# EAGLE design mux chip test mk2 (EAGLE 7.2.0)
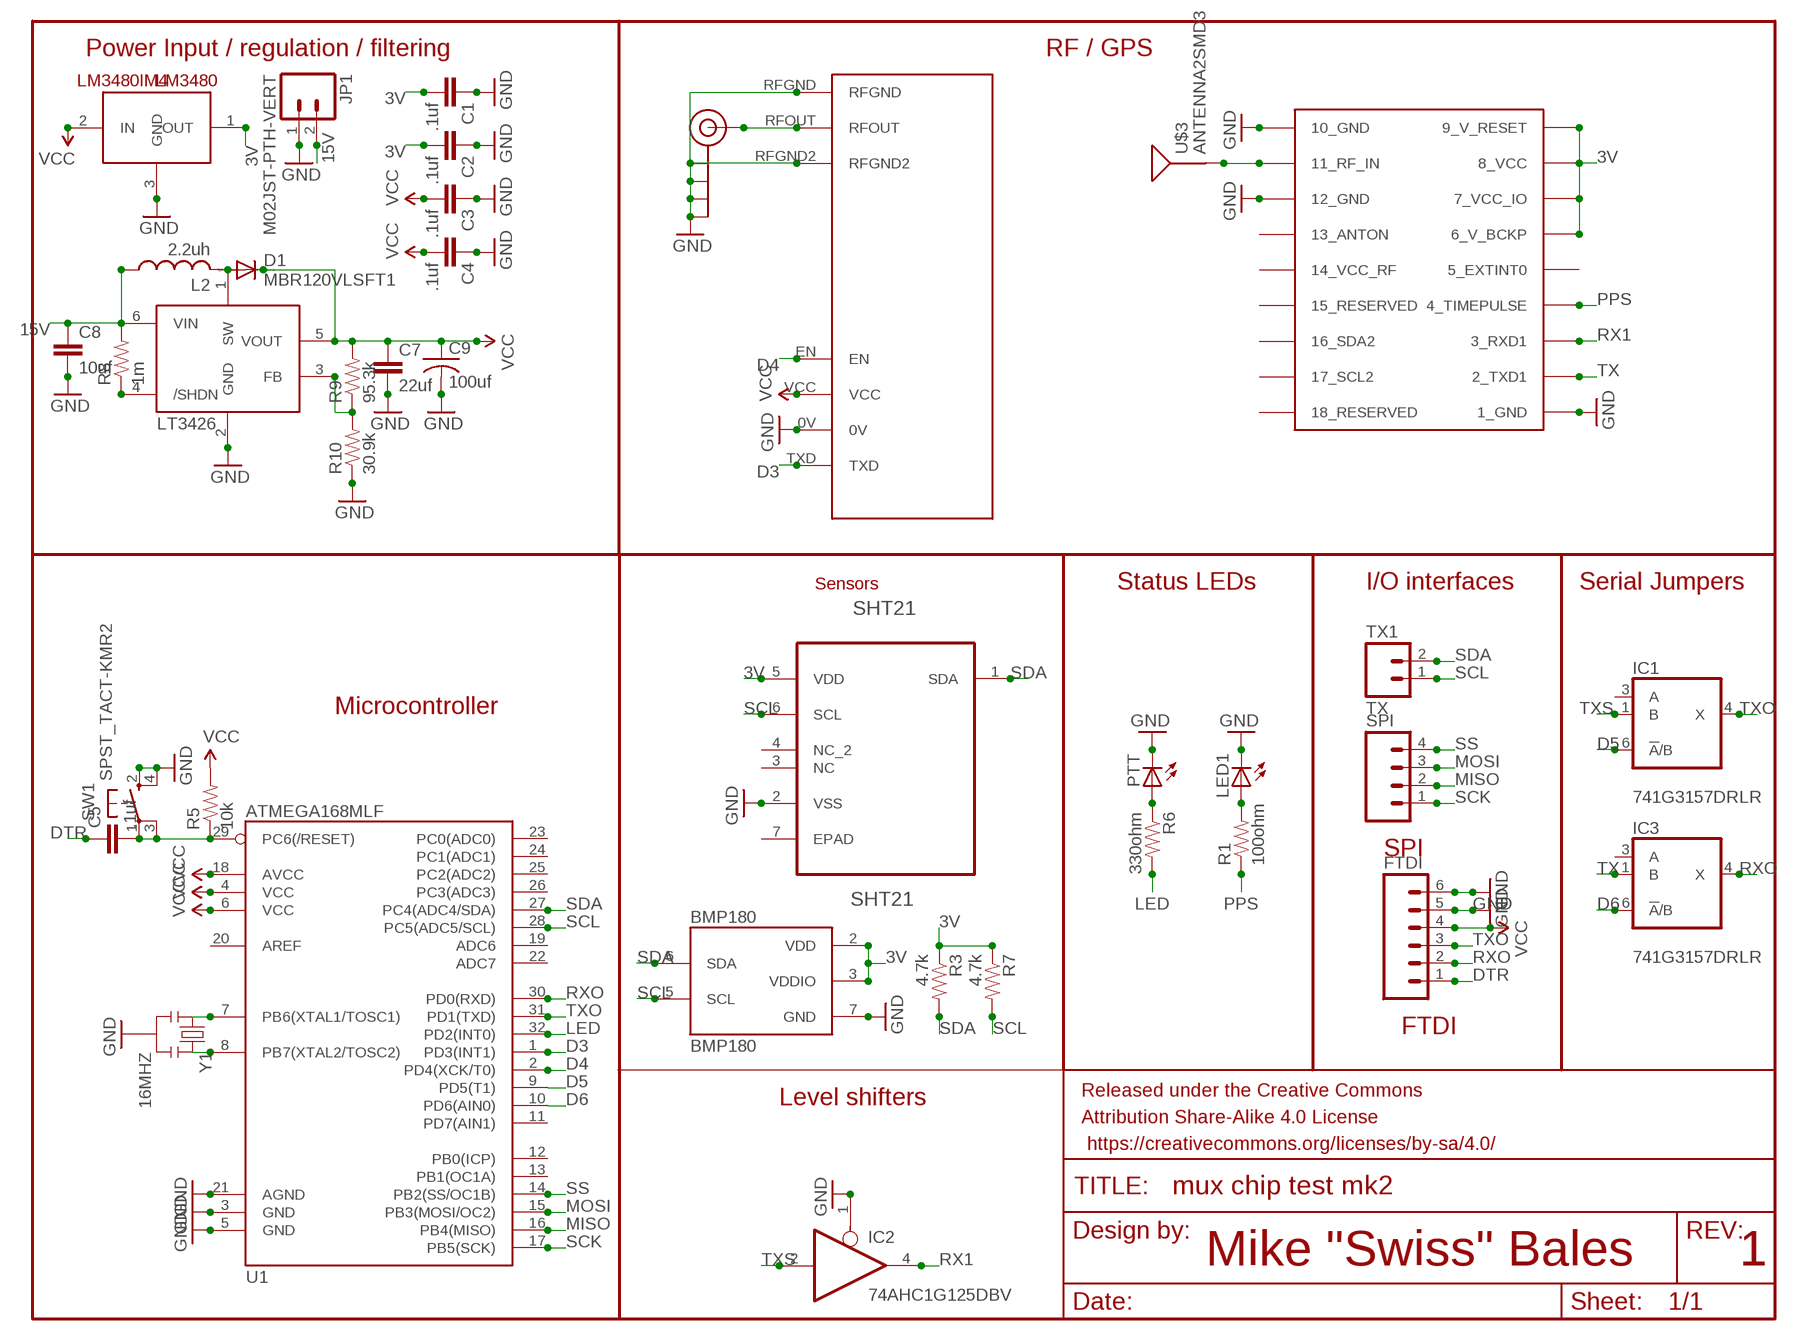
[diagram p0: schematic, sheet 1]

## Parts
BMP180  BMP180  [BMP180]
C1  .1uf  CAP0805  [0805]
C2  .1uf  CAP0805  [0805]
C3  .1uf  CAP0805  [0805]
C4  .1uf  CAP0805  [0805]
C5  .1uf  CAP0805  [0805]
C7  22uf  CAP0805  [0805]
C8  10uf  CAP0805  [0805]
C9  100uf  C-USC1206  [C1206]
D1  MBR120VLSFT1  DIODE-SOD123  [SOD123]
FRAME1  FRAME-LETTER  [CREATIVE_COMMONS]
FTDI  M06NO_SILK_FEMALE_PTH  [1X06_NO_SILK]
IC1  741G3157DRLR  [DRL_R-PDSO-N6]
IC2  74AHC1G125DBV  [SOT23-5]
IC3  741G3157DRLR  [DRL_R-PDSO-N6]
J$1  SMA_EDGE  [SMA-EDGE]
JP1  M02JST-PTH-VERT  [JST-2-PTH-VERT]
L2  2.2uh  L-USL1812  [L1812]
LED1  LEDCHIP-LED0805  [CHIP-LED0805]
LM3480  LM3480IM4  [SOT23-3]
LT3426  LT3426  [SOT23-6]
PTT  LEDCHIP-LED0805  [CHIP-LED0805]
R1  100ohm  RESISTOR0805-RES  [0805]
R3  4.7k  RESISTOR0805-RES  [0805]
R5  10k  RESISTOR0805-RES  [0805]
R6  330ohm  RESISTOR0805-RES  [0805]
R7  4.7k  RESISTOR0805-RES  [0805]
R8  1m  RESISTOR0805-RES  [0805]
R9  95.3k  RESISTOR0805-RES  [0805]
R10  30.9k  RESISTOR0805-RES  [0805]
SHT21  SHT21  [DFN300X300X110-7N]
SPI  M04JST-PTH-VERT  [JST-4-PTH-VERT]
SW1  SPST_TACT-KMR2  [KMR2]
TX1  TX  M02JST-PTH-VERT  [JST-2-PTH-VERT]
U1  ATMEGA168MLF  [MLF32]
U$1  UBLOX_MAX  [UBLOX_MAX]
U$2  RADIOMETRIX-HX1  [RADIOMETRIX-HX1]
U$3  ANTENNA2SMD3  [ANTENNA-CHIP4]
Y1  16MHZ  RESONATOR16MHZ  [RESONATOR-SMD]

## Nets
3V: BMP180.2(VDD) BMP180.3(VDDIO) C1.2 C2.2 LM3480.1(OUT) R3.1 R7.1 SHT21.5(VDD) U$1.6_V_BCKP U$1.7_VCC_IO U$1.8_VCC U$1.9_V_RESET
15V: C8.1 JP1.2 L2.1 LT3426.6(VIN) R8.2
D3: U1.1(PD3(INT1)) U$2.TXD
D4: U1.2(PD4(XCK/T0)) U$2.EN
D5: IC1.6(!A!/B) U1.9(PD5(T1))
D6: IC3.6(!A!/B) U1.10(PD6(AIN0))
DTR: C5.1 FTDI.1
GND: BMP180.7(GND) C1.1 C2.1 C3.1 C4.1 C7.2 C8.2 C9.2 FTDI.5 FTDI.6 IC2.1(OE) J$1.GND@0(GND) J$1.GND@1(GND) J$1.GND@2(GND) J$1.GND@3(GND) JP1.1 LED1.C LM3480.3(GND) LT3426.2(GND) PTT.C R10.1 SHT21.2(VSS) SW1.2(S) SW1.4(S1) U1.3(GND) U1.5(GND) U1.21(AGND) U$1.1_GND U$1.10_GND U$1.12_GND U$2.0V U$2.RFGND U$2.RFGND2 Y1.2
LED: R6.2 U1.32(PD2(INT0))
MISO: SPI.2 U1.16(PB4(MISO))
MOSI: SPI.3 U1.15(PB3(MOSI/OC2))
N$1: J$1.SIG(SIGNAL) U$2.RFOUT
N$3: LED1.A R1.2
N$6: U$1.11_RF_IN U$3.SIG(SIGNAL)
N$9: D1.A L2.2 LT3426.1(SW)
N$12: LT3426.4(/SHDN) R8.1
N$13: LT3426.3(FB) R9.1 R10.2
N$14: U1.8(PB7(XTAL2/TOSC2)) Y1.3
N$17: C5.2 R5.1 SW1.1(P) SW1.3(P1) U1.29(PC6(/RESET))
N$26: U1.7(PB6(XTAL1/TOSC1)) Y1.1
N$27: PTT.A R6.1
PPS: R1.1 U$1.4_TIMEPULSE
RX1: IC2.4(O) U$1.3_RXD1
RXO: FTDI.2 IC3.4(X) U1.30(PD0(RXD))
SCK: SPI.1 U1.17(PB5(SCK))
SCL: BMP180.5(SCL) R7.2 SHT21.6(SCL) TX1.1 U1.28(PC5(ADC5/SCL))
SDA: BMP180.6(SDA) R3.2 SHT21.1(SDA) TX1.2 U1.27(PC4(ADC4/SDA))
SS: SPI.4 U1.14(PB2(SS/OC1B))
TX: IC3.1(B) U$1.2_TXD1
TXO: FTDI.3 IC1.4(X) U1.31(PD1(TXD))
TXS: IC1.1(B) IC2.2(I)
VCC: C3.2 C4.2 C7.1 C9.1 D1.C FTDI.4 LM3480.2(IN) LT3426.5(VOUT) R5.2 R9.2 U1.4(VCC) U1.6(VCC) U1.18(AVCC) U$2.VCC
Unconnected: IC1.3(A) IC3.3(A) SHT21.3(NC) SHT21.4(NC_2) SHT21.7(EPAD) U1.11(PD7(AIN1)) U1.12(PB0(ICP)) U1.13(PB1(OC1A)) U1.19(ADC6) U1.20(AREF) U1.22(ADC7) U1.23(PC0(ADC0)) U1.24(PC1(ADC1)) U1.25(PC2(ADC2)) U1.26(PC3(ADC3)) U$1.5_EXTINT0 U$1.13_ANTON U$1.14_VCC_RF U$1.15_RESERVED U$1.16_SDA2 U$1.17_SCL2 U$1.18_RESERVED

## Notes on the sheet
- Power Input / regulation / filtering | RF / GPS
- Sensors | Status LEDs | I/O interfaces | Serial Jumpers
- Microcontroller
- SPI
- FTDI
- Level shifters
- Mike "Swiss" Bales | 1

## Power pins joined to a net without a drawn wire
GND: IC1.2(GND) IC2.3(GND) IC3.2(GND)
VCC: IC1.5(VCC) IC2.5(VCC) IC3.5(VCC)

## Library data of the parts
BMP180 = SparkFun-Sensors:BMP180: BOSCH BMP180 DIGITAL BAROMETRIC PRESSURE SENSOR Web page: http://www.bosch-sensortec.com/en/homepage/products_3/environmental_sensors_1/bmp180_1/bmp180 Datasheet: http://ae-bst.resource.bosch.com/media/products/dokumente/bmp180/BST-BMP180-DS000-09.pdf The BMP180 is the function compatible successor of the BMP085, a new generation of high precision digital pressure sensors for consumer applications. The ultra-low power, low voltage electronics of the BMP180 is optimized for use in mobile phones, PDAs, GPS navigation devices and outdoor equipment. With a low altitude noise of merely 0.25m at fast conversion time, the BMP180 offers superior performance. The I2C interface allows for easy system integration with a microcontroller. The BMP180 is based on piezo-resistive technology for EMC robustness, high accuracy and linearity as well as long term stability. Key features: - Temperature measurement included - I2C interface - Fully calibrated - Pb-free, halogen-free and RoHS compliant, - MSL 1 Basic specs: Pressure range: 300 to 1100hPa (+9000m to -500m relating to sea level) Supply voltage: 1.8 to 3.6V (VDD), 1.62V to 3.6V (VDDIO) Package: LGA package with metal lid Small footprint: 3.6mm x 3.8mm Super-flat: 0.93mm height Low power: 5μA at 1 sample / sec. in standard mode Low noise: 0.06hPa (0.5m) in ultra low power mode, 0.02hPa (0.17m) advanced resolution mode Typical applications: - Enhancement of GPS navigation (dead-reckoning, slope detection, etc.) - In- and out-door navigation - Leisure and sports - Weather forecast - Vertical velocity indication (rise/sink speed)
C1-C5 C7 C8 = SparkFun-Capacitors:CAP: Capacitor Standard 0603 ceramic capacitor, and 0.1" leaded capacitor.
C9 = resistor:C-US: CAPACITOR, American symbol
D1 = diode:DIODE-: DIODE
FRAME1 = SparkFun-Aesthetics:FRAME-LETTER: Schematic Frame Standard 8.5x11 US Letter frame
FTDI = SparkFun-Connectors:M06: Header 6 Standard 6-pin 0.1" header. Use with straight break away headers (SKU : PRT-00116), right angle break away headers (PRT-00553), swiss pins (PRT-00743), machine pins (PRT-00117), and female headers (PRT-00115). Molex polarized connector foot print use with SKU : PRT-08094 with associated crimp pins and housings. NOTES ON THE VARIANTS LOCK and LOCK_LONGPADS... This footprint was designed to help hold the alignment of a through-hole component (i.e. 6-pin header) while soldering it into place. You may notice that each hole has been shifted either up or down by 0.005 of an inch from it's more standard position (which is a perfectly straight line). This slight alteration caused the pins (the squares in the middle) to touch the edges of the holes. Because they are alternating, it causes a "brace" to hold the component in place. 0.005 has proven to be the perfect amount of "off-center" position when using our standard breakaway headers. Although looks a little odd when you look at the bare footprint, once you have a header in there, the alteration is very hard to notice. Also,if you push a header all the way into place, it is covered up entirely on the bottom side. This idea of altering the position of holes to aid alignment will be further integrated into the Sparkfun Library for other footprints. It can help hold any component with 3 or more connection pins.; PROD_ID: CONN-08437
IC1 IC3 = 74xx-little-us:74*1G3157: Single-Pole, Double-Throw Analog Switch Source: http://focus.ti.com/lit/ds/symlink/sn74lvc1g3157.pdf
IC2 = 74xx-little-us:74*1G125: Single Bus Buffer Gate with 3-State Output
J$1 = SparkFun-Connectors:SMA_EDGE: SMA Antenna Connector End launch SMA connector. The paste layer has been removed so that the connector can be hand soldered onto the board after reflow.
JP1 TX1 = SparkFun-Connectors:M02: Standard 2-pin 0.1" header. Use with - straight break away headers ( PRT-00116) - right angle break away headers (PRT-00553) - swiss pins (PRT-00743) - machine pins (PRT-00117) - female headers (PRT-00115) Molex polarized connector foot print use with: PRT-08233 with associated crimp pins and housings. 2.54_SCREWTERM for use with PRT-10571. 3.5mm Screw Terminal footprints for PRT-08084 5mm Screw Terminal footprints for use with PRT-08432
L2 = resistor:L-US: INDUCTOR, American symbol
LED1 PTT = adafruit:LED: LED OSRAM: - CHIPLED LG R971, LG N971, LY N971, LG Q971, LY Q971, LO R971, LY R971 LH N974, LH R974 LS Q976, LO Q976, LY Q976 LO Q996 - Hyper CHIPLED LW Q18S LB Q993, LB Q99A, LB R99A - SideLED LS A670, LO A670, LY A670, LG A670, LP A670 LB A673, LV A673, LT A673, LW A673 LH A674 LY A675 LS A676, LA A676, LO A676, LY A676, LW A676 LS A679, LY A679, LG A679 - Hyper Micro SIDELED® LS Y876, LA Y876, LO Y876, LY Y876 LT Y87S - SmartLED LW L88C, LW L88S LB L89C, LB L89S, LG L890 LS L89K, LO L89K, LY L89K LS L896, LA L896, LO L896, LY L896 - TOPLED LS T670, LO T670, LY T670, LG T670, LP T670 LSG T670, LSP T670, LSY T670, LOP T670, LYG T670 LG T671, LOG T671, LSG T671 LB T673, LV T673, LT T673, LW T673 LH T674 LS T676, LA T676, LO T676, LY T676, LB T676, LH T676, LSB T676, LW T676 LB T67C, LV T67C, LT T67C, LS T67K, LO T67K, LY T67K, LW E67C LS E67B, LA E67B, LO E67B, LY E67B, LB E67C, LV E67C, LT E67C LW T67C LS T679, LY T679, LG T679 LS T770, LO T770, LY T770, LG T770, LP T770 LB T773, LV T773, LT T773, LW T773 LH T774 LS E675, LA E675, LY E675, LS T675 LS T776, LA T776, LO T776, LY T776, LB T776 LHGB T686 LT T68C, LB T68C - Hyper Mini TOPLED® LB M676 - Mini TOPLED Santana® LG M470 LS M47K, LO M47K, LY M47K Source: http://www.osram.convergy.de/
LM3480 = SparkFun-PowerIC:LM3480IM4: Small package linear regulator
LT3426 = adafruit:LT3426: LT3426 1.2MHz, 2A boost converter in SOT-23 http://www.linear.com/pc/productDetail.jsp?navId=H0,C1,C1003,C1042,C1031,C1061,P8430 (Linear website)
R1 R3 R5-R10 = SparkFun-Resistors:RESISTOR: Resistor Basic schematic elements and footprints for 0603, 1206, and PTH resistors.
SHT21 = sht21:SHT21: SENSOR, HUMIDITY & TEMP; MPN: SHT21; OC_FARNELL: 1855468; OC_NEWARK: 20T1172; PACKAGE: DFN-6; SUPPLIER: SENSIRION
SPI = SparkFun-Connectors:M04: Header 4 Standard 4-pin 0.1" header. Use with straight break away headers (SKU : PRT-00116), right angle break away headers (PRT-00553), swiss pins (PRT-00743), machine pins (PRT-00117), and female headers (PRT-00115). Molex polarized connector foot print use with SKU : PRT-08231 with associated crimp pins and housings. 1MM SMD Version SKU: PRT-10208
SW1 = adafruit:SPST_TACT: SMT 6mm switch, EVQQ2 series http://www.ladyada.net/library/eagle
U1 = SparkFun-DigitalIC:ATMEGA168: Atmel 32-pin 8-bit micro, 16k flash.
U$1 = Ava:UBLOX_MAX: UBLOX MAX
U$2 = Ava:RADIOMETRIX-HX1
U$3 = SparkFun-RF:ANTENNA2: Chip antenna Single endded antenna. Common with smaller chip antennas. CHIP4 package is the GPS Chip Antenna SKU: GPS-08418. CHIP5 package is 2.4GHz chip antenna SKU: WRL-00144.
Y1 = SparkFun-FreqCtrl:RESONATOR: Resonator Small SMD resonator. Used, eg, on the Arduino Pro/ Pro Mini boards. 8MHz- XTAL-08895 16MHz- XTAL-08900; PROD_ID: XTAL-08900

## Board
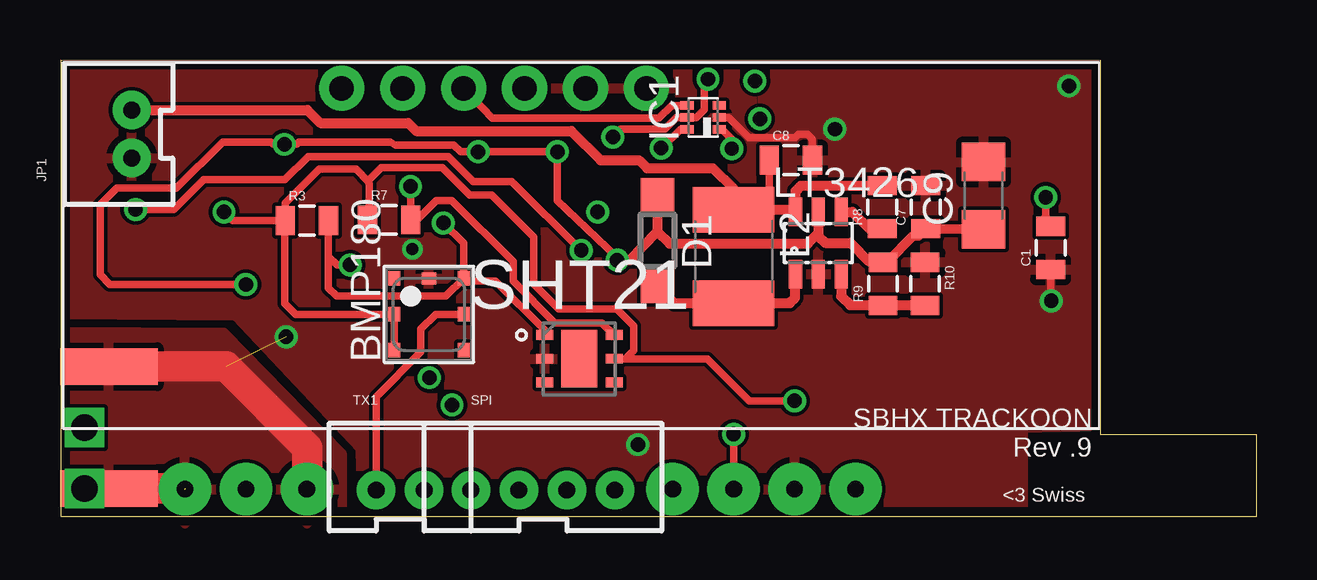
[diagram p1: board, top side]
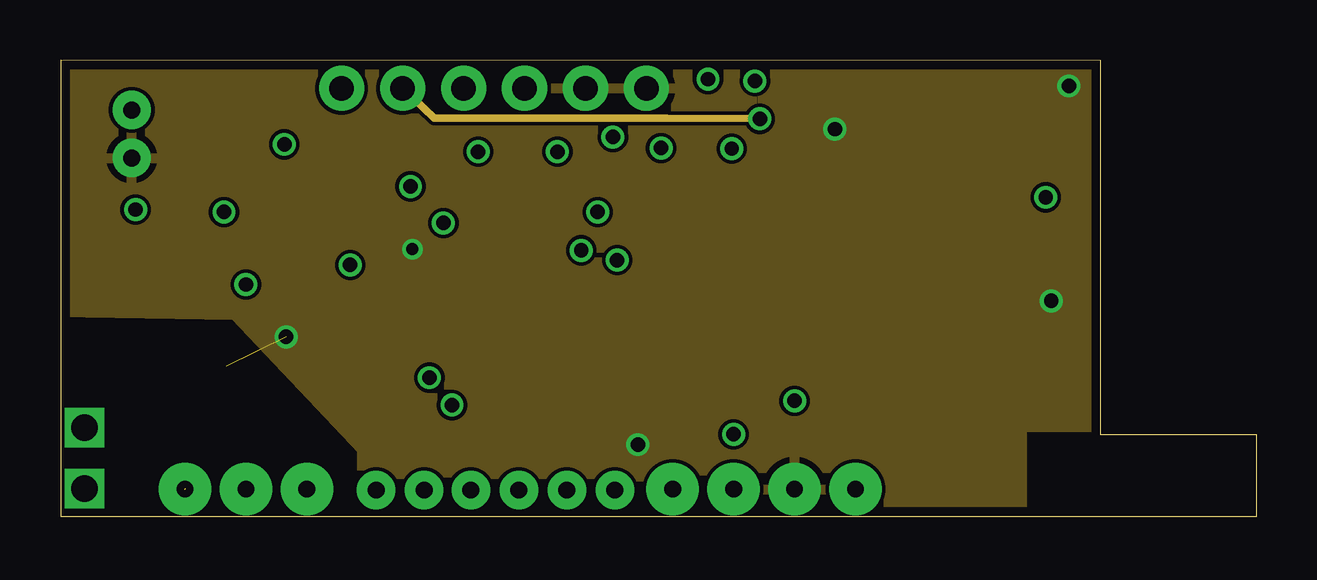
[diagram p2: board, inner layer Route2]
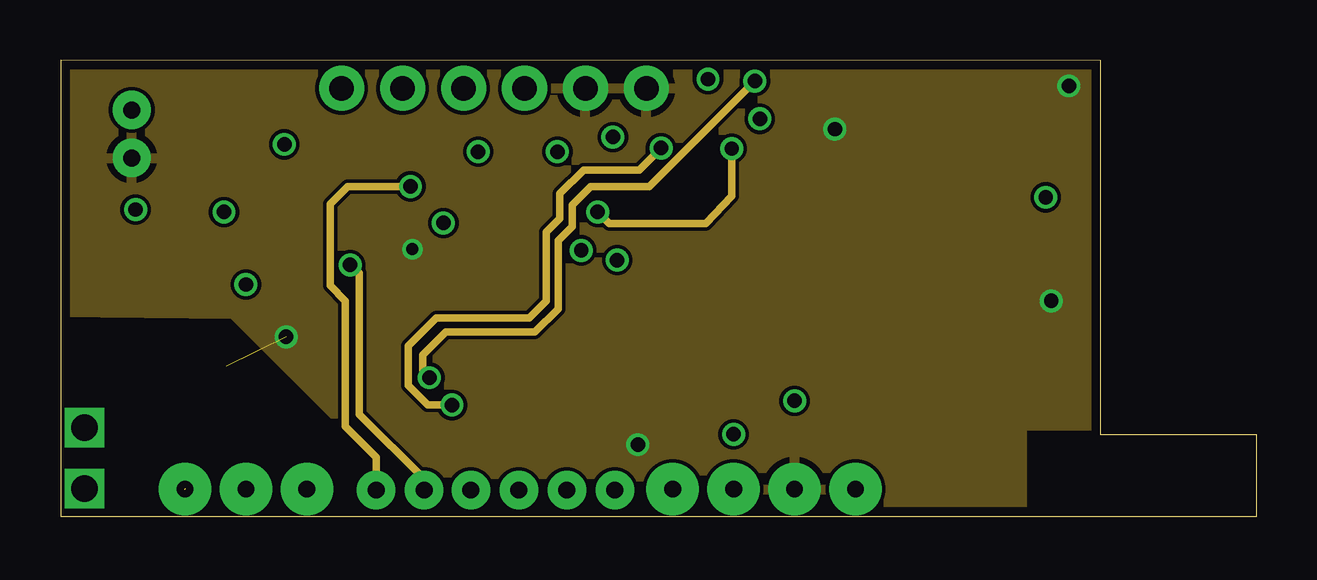
[diagram p3: board, inner layer Route15]
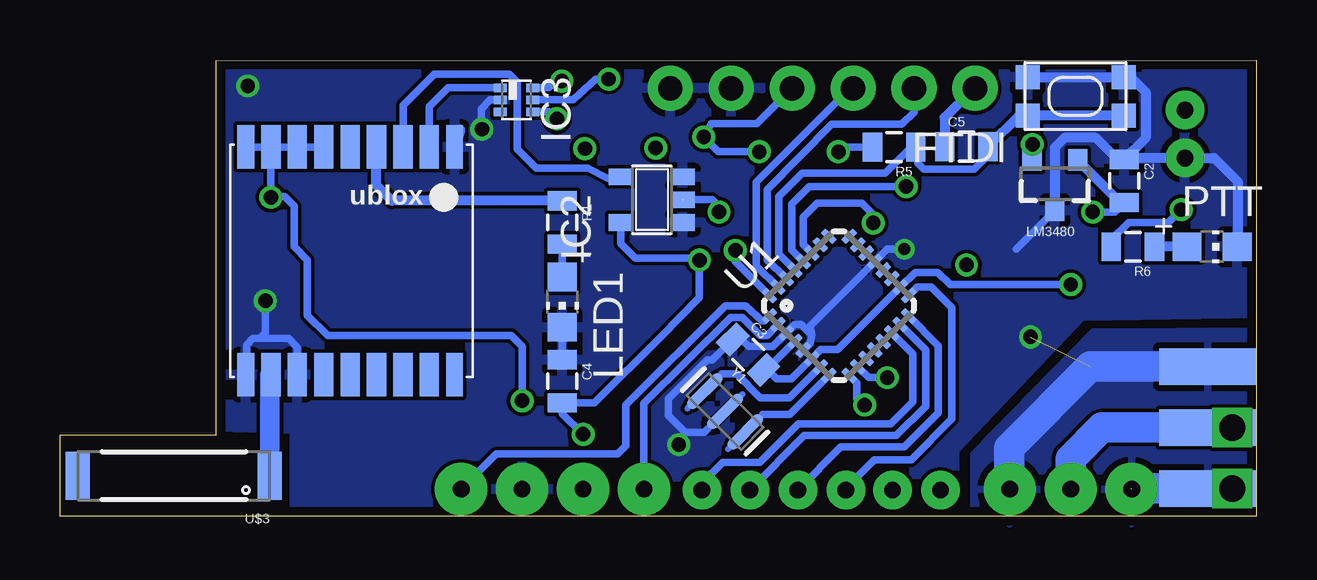
[diagram p4: board, bottom side, seen from below]

Size 49.83 x 19.04 mm. Coordinates in mm from the lower left corner, seen from the top.
Outline: 0,0 49.84,0 49.84,3.4 43.33,3.4 43.33,3.45 43.33,19.02 0,19.04 0,0
Copper layers (1*2*15*16): Top 0.0356mm / dielectric 1.5011mm / Route2 0.0356mm / dielectric 0.1499mm / Route15 0.0356mm / dielectric 0.2007mm / Bottom 0.0356mm
Design rules "oshpark-2layer *": minimum track width 6mil, minimum drill 13mil, track to track 6mil, track to pad 6mil, pad to pad 6mil, via to via 6mil, smd to smd 6mil, copper to edge 15mil, drill to drill 6mil, minimum pad ring 7mil, minimum via ring 7mil, stop-mask expansion 4mil, vias tented up to drill 0mil, thermal gap 10mil

### Footprints (pad centres in the part's own frame; a part is rotated, then mirrored left to right if it is on the bottom)
BMP180 = smd 0.6 x 0.5: 1 1.5,1.45; 2 0,1.45; 3 -1.5,1.45; 4 -1.5,-1.45; 5 0,-1.45; 6 1.5,-1.45 | smd 0.5 x 0.6: 7 1.5,0
0805 = smd 0.8 x 1.2: 1 -0.9,0; 2 0.9,0
C1206 = smd 1.6 x 1.8: 1 -1.4,0; 2 1.4,0
SOD123 = smd 1.4 x 1.4: A 1.9,0; C -1.9,0
1X06_NO_SILK = drill 1.016 pad 1.88: 1 0,0; 2 2.54,0; 3 5.08,0; 4 7.62,0; 5 10.16,0; 6 12.7,0
DRL_R-PDSO-N6 = smd 0.35 x 0.55: 1 -0.5,-0.675; 2 0,-0.675; 3 0.5,-0.675; 4 0.5,0.675; 5 0,0.675; 6 -0.5,0.675
SOT23-5 = smd 0.69 x 0.99: 1 -0.95,-1.29; 2 0,-1.29; 3 0.95,-1.29; 4 0.95,1.3; 5 -0.95,1.3
SMA-EDGE = smd 1.524 x 4.064: GND@0 0,0; GND@1 5.08,0; SIG 2.54,0 | smd 1.524 x 4.064 bottom: GND@2 0,0; GND@3 5.08,0
JST-2-PTH-VERT = drill 0.7 pad 1.6: 1 -1,-0.55; 2 1,-0.55
L1812 = smd 1.9 x 3.4: 1 -1.95,0; 2 1.95,0
CHIP-LED0805 = smd 1.2 x 1.2: A 0,-1.05; C 0,1.05
SOT23-3 = smd 0.8 x 0.9: 1 -0.95,-1; 2 0.95,-1; 3 0,1.1
SOT23-6 = smd 0.55 x 1.2: 1 -0.95,-1.3; 2 0,-1.3; 3 0.95,-1.3; 4 0.95,1.3; 5 0,1.3; 6 -0.95,1.3
DFN300X300X110-7N = smd 0.711 x 0.406: 1 -1.448,0.991; 2 -1.448,0; 3 -1.448,-0.991; 4 1.448,-0.991; 5 1.448,0; 6 1.448,0.991 | smd 1.499 x 2.388: 7 0,0
JST-4-PTH-VERT = drill 0.7 pad 1.6: 1 -3,-0.55; 2 -1,-0.55; 3 1,-0.55; 4 3,-0.55
KMR2 = smd 1 x 1: 1 2,0.8; 2 2,-0.8; 3 -2,0.8; 4 -2,-0.8
MLF32 = smd 0.7 x 0.3: 1 -2.35,1.75; 2 -2.35,1.25; 3 -2.35,0.75; 4 -2.35,0.25; 5 -2.35,-0.25; 6 -2.35,-0.75; 7 -2.35,-1.25; 8 -2.35,-1.75; 17 2.35,-1.75; 18 2.35,-1.25; 19 2.35,-0.75; 20 2.35,-0.25; 21 2.35,0.25; 22 2.35,0.75; 23 2.35,1.25; 24 2.35,1.75 | smd 0.3 x 0.7: 9 -1.75,-2.35; 10 -1.25,-2.35; 11 -0.75,-2.35; 12 -0.25,-2.35; 13 0.25,-2.35; 14 0.75,-2.35; 15 1.25,-2.35; 16 1.75,-2.35; 25 1.75,2.35; 26 1.25,2.35; 27 0.75,2.35; 28 0.25,2.35; 29 -0.25,2.35; 30 -0.75,2.35; 31 -1.25,2.35; 32 -1.75,2.35
UBLOX_MAX = smd 1.8 x 0.7: 1_GND 4.95,-4.4; 9_V_RESET 4.95,4.3; 10_GND -4.55,4.3; 18_RESERVED -4.55,-4.4 | smd 1.8 x 0.8: 2_TXD1 4.95,-3.35; 3_RXD1 4.95,-2.25; 4_TIMEPULSE 4.95,-1.15; 5_EXTINT0 4.95,-0.05; 6_V_BCKP 4.95,1.05; 7_VCC_IO 4.95,2.15; 8_VCC 4.95,3.25; 11_RF_IN -4.55,3.25; 12_GND -4.55,2.15; 13_ANTON -4.55,1.05; 14_VCC_RF -4.55,-0.05; 15_RESERVED -4.55,-1.15; 16_SDA2 -4.55,-2.25; 17_SCL2 -4.55,-3.35
RADIOMETRIX-HX1 = drill 0.7 pad 2.184: 0V 8.89,-10.16; EN 3.81,-10.16; RFGND -11.43,-10.16; RFGND2 -16.51,-10.16; RFOUT -13.97,-10.16; TXD 11.43,-10.16; VCC 6.35,-10.16
ANTENNA-CHIP4 = smd 1 x 2: NC 4,0; SIG -4,0
RESONATOR-SMD = smd 0.45 x 1.905: 1 -1.2,0; 2 0,0; 3 1.2,0

### Placement (x,y rotation side)
BMP180  15.34,8.43 90 top
C1  41.25,11.2 90 top
C2  5.49,14 270 bottom
C3  21.16,6.76 315 bottom
C4  28.91,5.64 270 bottom
C5  12.07,15.43 0 bottom
C7  36.04,12.9 90 top
C8  30.43,14.86 0 top
C9  38.46,13.39 90 top
D1  24.87,11.51 270 top
FRAME1  14.38,-8.15 0 top  (outside the outline)
FTDI  11.71,17.86 180 bottom
IC1  26.77,16.64 90 top
IC2  25.17,13.21 90 bottom
IC3  30.81,17.37 270 bottom
J$1  2.01,1.17 90 bottom
JP1  2.41,15.95 90 top
L2  28.04,10.85 270 top
LED1  28.91,8.94 180 bottom
LM3480  8.38,13.87 180 bottom
LT3426  31.57,11.4 0 top
PTT  1.83,11.25 270 bottom
R1  28.91,12.27 270 bottom
R3  10.26,12.34 0 top
R5  15.08,15.41 180 bottom
R6  5.13,11.25 180 bottom
R7  13.69,12.37 0 top
R8  34.24,12.9 90 top
R9  34.26,9.7 90 top
R10  36.02,9.7 270 top
SHT21  21.62,6.58 0 top
SPI  20.09,1.65 0 top
SW1  7.52,17.53 180 bottom
TX1  14.15,1.65 0 top
U1  17.37,8.79 45 bottom
U$1  37.8,10.46 90 bottom
U$2  21.69,11.3 0 top
U$3  45.09,1.7 180 bottom
Y1  22.13,4.38 315 bottom

### Tracks (layer width: path | path; a pad name or v marks a point on that pad's centre or on a via)
3V  (via drill 0.6)
  Top 0.305: R3.1 7.16,12.34 v6.81,12.7 | R3.1 9.36,13.07 10.77,14.48 12.32,14.48 12.8,13.99 | 12.8,13.99 12.85,13.88 12.85,12.43 R7.1 | 12.8,13.99 13.36,14.55 15.9,14.55 17.04,13.41 17.96,13.41 19.71,11.66 19.71,9.7 20.75,8.66 23.16,8.66 23.88,7.95 23.88,6.93 23.52,6.58 SHT21.5 26.95,6.58 28.7,4.83 v30.58,4.83 | v41.05,13.31 41.05,12.44 | 9.37,12.33 R3.1 | BMP180.3 BMP180.2 9.8,8.43 9.35,8.89 9.35,12.33 R3.1
  Top 0.406: 41.05,12.44 41.05,12.3 C1.2
  Bottom 0.305: U$1.6_V_BCKP U$1.7_VCC_IO U$1.8_VCC | U$1.8_VCC U$1.9_V_RESET | v6.81,12.7 5.88,12.7 C2.2 | U$1.8_VCC 41.05,14.05 v41.05,13.31 41.02,13.34 40.46,13.34 40.08,12.95 40.08,11.25 39.52,10.69 39.52,8.38 38.68,7.54 31.04,7.54 30.58,7.09 v30.58,4.83
  Bottom 0.406: C2.2 5.66,13.1 LM3480.1
15V
  Top 0.305: 29.13,12.8 29.53,13.19 C8.1
  Top 0.406: JP1.2 10.28,16.95 10.82,16.41 14.48,16.41 14.81,16.08 21.29,16.08 22.5,14.86 24.11,14.86 24.43,14.53 27.18,14.53 28.04,13.66 L2.1 29.13,12.8 30.53,12.8 LT3426.6 30.62,13.58 30.84,13.79 34.23,13.79 R8.2
D3
  Bottom 0.305: U1.1 20.48,8.15 20.57,8.15 21.26,8.79 22.12,8.79 26.26,4.65 26.26,2.95 26.59,2.62 31.65,2.62 U$2.TXD
D4
  Bottom 0.305: U1.2 20.36,7.54 20.65,7.54 21.41,8.31 21.89,8.31 25.5,4.72 U$2.EN
D5  (via drill 0.6)
  Top 0.305: IC1.6 25.81,16.14 v25.02,15.37
  Route15 0.305: v16.31,4.65 15.29,4.65 14.48,5.46 14.48,7.11 15.65,8.28 19.53,8.28 20.24,8.99 20.24,11.86 20.8,12.42 20.8,13.46 21.79,14.45 24.11,14.45 v25.02,15.37
  Bottom 0.305: U1.9 16.64,5.58 16.64,4.88 16.41,4.65 v16.31,4.65
D6  (via drill 0.6)
  Route15 0.305: v28.93,18.16 24.54,13.77 22.1,13.77 21.31,12.98 21.31,12.09 20.73,11.51 20.73,8.66 19.76,7.7 16.05,7.7 15.09,6.73 15.09,6.07 v15.37,5.79
  Bottom 0.305: U1.10 16.14,5.79 v15.37,5.79 | IC3.6 29.47,17.87 29.18,18.16 v28.93,18.16
DTR
  Bottom 0.406: FTDI.1 11.76,17.86 12.98,16.64 C5.1
GND  (via drill 0.5, 0.6, 1.1)  (2 unrouted)
  Top 0.305: C1.1 41.25,9.02 v41.27,8.99 | IC1.2 27.84,16.64 28.68,15.8 30.61,15.8 30.76,15.95 31.11,15.95 31.32,15.75 31.32,14.87 C8.2
  Top 1.27: J$1.GND@1 6.91,6.25 10.29,2.87 10.29,1.17 U$2.RFGND | 1.91,1.17 5.21,1.17
  Bottom 0.305: U1.5 18.57,7.24 18.52,7.57 | 18.52,7.57 18.95,8 19.22,8 U1.3 20.14,7.09 21.13,7.09 21.44,7.39 C3.1 22.66,6.53 22.86,6.53 24.49,4.9 24.49,4.22 23.77,3.5 23,3.5 22.84,3.66 | 18.52,7.57 18.57,7.95 U1.21 15.37,11.15 v14.66,11.15 | U$1.12_GND 39.95,7.05 40.31,7.42 41.5,7.42 | 41.5,7.42 41.81,7.42 42.06,7.16 42.06,6.05 U$1.10_GND | LED1.C C4.1 | LM3480.3 10,11.15 | v41.27,8.99 41.27,7.64 41.5,7.42 | IC3.2 31.9,17.37 32.28,16.99 v32.26,16.15
  Bottom 0.406: SW1.2 SW1.4 5.22,18.33 4.6,17.7 4.6,15.78 C2.1 | PTT.C 0.76,11.27 0.76,13.97 1.74,14.95 JP1.1 5.43,14.95 C2.1 | C2.1 5.78,14.89 6.68,15.8 7.98,15.8 8.38,15.39 LM3480.3 | 33.16,16.15 U$1.1_GND
  Bottom 1.27: U$2.RFGND2 5.16,1.17 J$1.GND@2 | J$1.GND@1 6.91,6.25 10.29,2.87 10.29,1.17 U$2.RFGND
  other vias: 42.01,17.96 9.4,7.49 0.99,1.17 24.05,3
  pour Top: -0.13,19.05 43.33,18.97 43.31,4.11 43.31,3.76 40.08,3.68 40.08,-0.58 35.92,-0.56 12.6,-0.48 12.5,2.82 7.29,8.36 -0.1,8.43
  pour Bottom: -0.15,19.05 43.33,19 43.31,4.14 43.31,3.76 40.08,3.66 40.08,-0.64 35.97,-0.58 12.7,-0.48 12.55,-0.33 12.55,2.79 7.29,8.36 -0.2,8.48
  pour Top: -0.1,7.72 6.81,7.67 11.71,2.64 11.71,-0.48 -0.1,-0.36
  pour Bottom: -0.1,7.75 6.78,7.7 11.76,2.59 11.76,-0.46 0,-0.43
  pour Route15: -0.13,19.05 43.28,19.05 43.28,3.78 40.06,3.78 40.06,-0.61 12.73,-0.46 12.6,-0.33 12.93,2.69 7.19,8.43 -0.18,8.51
  pour Route2: -0.13,19.05 43.31,19.05 43.31,3.71 40.06,3.71 40.06,-0.64 12.6,-0.38 12.57,-0.36 12.57,2.77 7.26,8.38 -0.2,8.51
LED  (via drill 0.6)
  Top 0.305: v3.12,12.8 4.72,12.8 5.97,14.05 9.35,14.05 10.31,15.01 16.15,15.01 17.2,13.97 18.8,13.97 v21.69,11.1
  Bottom 0.305: R6.2 6.03,11.55 5.31,12.27 3.66,12.27 v3.12,12.8 | v21.69,11.1 21.69,10.63 U1.32
MISO
  Bottom 0.305: U1.16 13.23,7.12 13.23,4.32 14.66,2.9 17.3,2.9 SPI.2
MOSI
  Bottom 0.305: U1.15 13.77,6.95 13.77,4.6 14.99,3.38 18.81,3.38 SPI.3
N$1
  Bottom 1.27: J$1.SIG 6.43,3.71 7.72,2.41 U$2.RFOUT
N$3
  Bottom 0.305: R1.2 LED1.A
N$6
  Bottom 0.813: U$1.11_RF_IN 41.09,5.92 U$3.SIG
N$9
  Top 0.406: LT3426.1 30.61,10.09 30.61,9.12 30.38,8.9 L2.2 25.58,8.89 D1.A
N$12
  Top 0.406: LT3426.4 32.99,12.71 33.71,11.99 34.23,11.99 R8.1
N$13
  Top 0.406: R10.2 R9.1 34.25,8.81 32.89,8.81 32.52,9.19 LT3426.3
N$14
  Bottom 0.305: U1.8 19.44,4.25 20.56,4.25
N$17
  Bottom 0.305: C5.2 11.17,15.04 11.73,14.48 13.84,14.48 14.1,14.73 R5.1 14.36,15.41 15.44,14.33 18.9,14.33 19.89,13.34 19.89,10.95 U1.29
  Bottom 0.406: SW1.3 SW1.1 9.87,16.73 C5.2
N$18  (via drill 1.1)
  other vias: 0.99,3.71
N$26
  Bottom 0.305: U1.7 19.44,4.95 20.65,4.95 21.64,5.95 22.26,5.95
N$27
  Bottom 0.406: PTT.A R6.1
PPS
  Bottom 0.406: R1.1 36,13.17 36.65,13.82 U$1.4_TIMEPULSE
RX1
  Bottom 0.305: IC2.4 27.04,14.11 27.84,14.53 30,14.53 30.79,15.32 30.79,18.11 31.11,18.44 34.24,18.44 35.53,17.14 35.53,15.43 U$1.3_RXD1
RXO  (via drill 0.6)
  Route2 0.305: v29.13,16.59 25.25,16.61 15.57,16.61 FTDI.2
  Bottom 0.305: U1.30 20.37,10.7 20.37,13.64 17.68,16.36 14.76,16.36 14.25,16.87 FTDI.2 | IC3.4 29.45,16.87 v29.13,16.59
SCK
  Bottom 0.305: U1.17 14.11,9.58 13.54,9.58 12.68,8.71 12.68,4.06 14.38,2.36 15.9,2.36 17.09,1.17 SPI.1
SCL  (via drill 0.6)
  Top 0.305: R7.2 14.59,13.27 v14.58,13.77 | SHT21.6 22.55,8.08 20.6,8.08 18.86,9.82 U1.28 16.3,13.18 15.65,13.18 14.83,12.37 R7.2 | R7.2 14.67,12.15 | TX1.1 13.15,4.99 15.01,6.86 15.01,7.82 15.62,8.43 BMP180.5
  Route15 0.305: TX1.1 13.15,2.47 11.86,3.76 11.86,8.99 11.23,9.63 11.23,13.03 11.96,13.77 v14.58,13.77
  Bottom 0.305: U1.28 19.36,11.12 19.36,13.03 18.62,13.77 v14.58,13.77
SDA  (via drill 0.6)
  Top 0.305: R3.2 11.16,10.85 | 11.16,10.85 11.16,9.54 11.51,9.2 16.05,9.2 BMP180.6 | BMP180.6 16.79,11.4 v15.95,12.24 | SHT21.1 20.17,7.77 18.11,9.83 16.89,9.83 BMP180.6 | v12.06,10.49 11.52,10.49 11.16,10.85
  Route15 0.305: TX1.2 15.15,1.56 12.45,4.27 12.45,10.16 v12.06,10.49
  Bottom 0.305: v15.95,12.24 15.95,12.6 16.43,13.08 18.29,13.08 18.87,12.5 18.87,11.35 U1.27
SS
  Bottom 0.305: U1.14 14.3,6.78 14.3,4.78 15.21,3.86 19.07,3.86 20.68,2.26 22.23,2.26 23.09,1.39 SPI.4
TX
  Bottom 0.305: IC3.1 33.66,17.87 34.44,17.09 U$1.2_TXD1
TXO
  Top 0.305: IC1.4 25.47,17.14 24.92,16.61 17.98,16.61 FTDI.3
  Bottom 0.305: U1.31 20.83,10.45 20.83,13.95 16.92,17.86 FTDI.3
TXS  (via drill 0.6)
  Top 0.305: IC1.1 27.58,16.14 27.96,15.75 v27.96,15.34
  Route15 0.305: v27.96,15.34 27.96,13.36 26.87,12.22 22.86,12.22 v22.38,12.7
  Bottom 0.305: v22.38,12.7 22.38,12.93 22.66,13.21 IC2.2
VCC  (via drill 0.6)
  Top 0.305: v7.72,9.68 2.06,9.68 1.65,10.08 1.65,13.01 2.34,13.69 4.83,13.69 6.76,15.62 8.76,15.62 8.87,15.52 v9.32,15.52 9.83,15.52 9.93,15.62 13.74,15.62 13.97,15.49 16.38,15.49 16.66,15.21 v17.4,15.21 v20.7,15.21 20.7,13.18 23.19,10.79 v23.19,10.69 | U$2.VCC v28.04,3.43 | v23.01,15.82 23.34,16.15 25.17,16.15 25.65,16.64 IC1.5 26.49,16.64 26.82,16.97 26.82,18.11 v26.98,18.24
  Top 0.406: 34.23,10.64 33.68,10.64 32.92,11.4 31.85,11.4 31.57,11.68 LT3426.5 31.57,11.81 31.14,11.38 25.38,11.38 24.87,11.89 | 34.23,10.64 R9.2 | 34.23,10.64 34.47,10.64 35.53,11.71 35.75,11.71 C7.1 36.21,12 C9.1 | D1.C 24.87,11.89 | v23.19,10.69 23.72,10.69 24.87,11.89
  Bottom 0.305: U1.4 20.34,6.17 C3.2 20.37,6.14 19.96,5.74 19.36,5.74 U1.6 18.14,6.96 17.43,6.96 U1.18 14.21,10.19 13.26,10.19 12.75,9.68 v7.72,9.68 | FTDI.4 20.8,16.38 22.71,16.38 v23.01,15.82 22.4,15.21 v20.7,15.21 | v9.32,15.52 LM3480.2 | R5.2 17.05,15.41 v17.4,15.21 | v28.04,3.43 28.91,4.28 C4.2 27.57,4.74 24.79,7.52 23.19,9.14 v23.19,10.69 23.27,10.77 25.86,10.77 26.47,11.38 IC2.5 | v26.98,18.24 27.51,18.24 28.45,17.37 IC3.5

### Text on the board
tNames: SBHX TRACKOON / Rev .9 | <3 Swiss